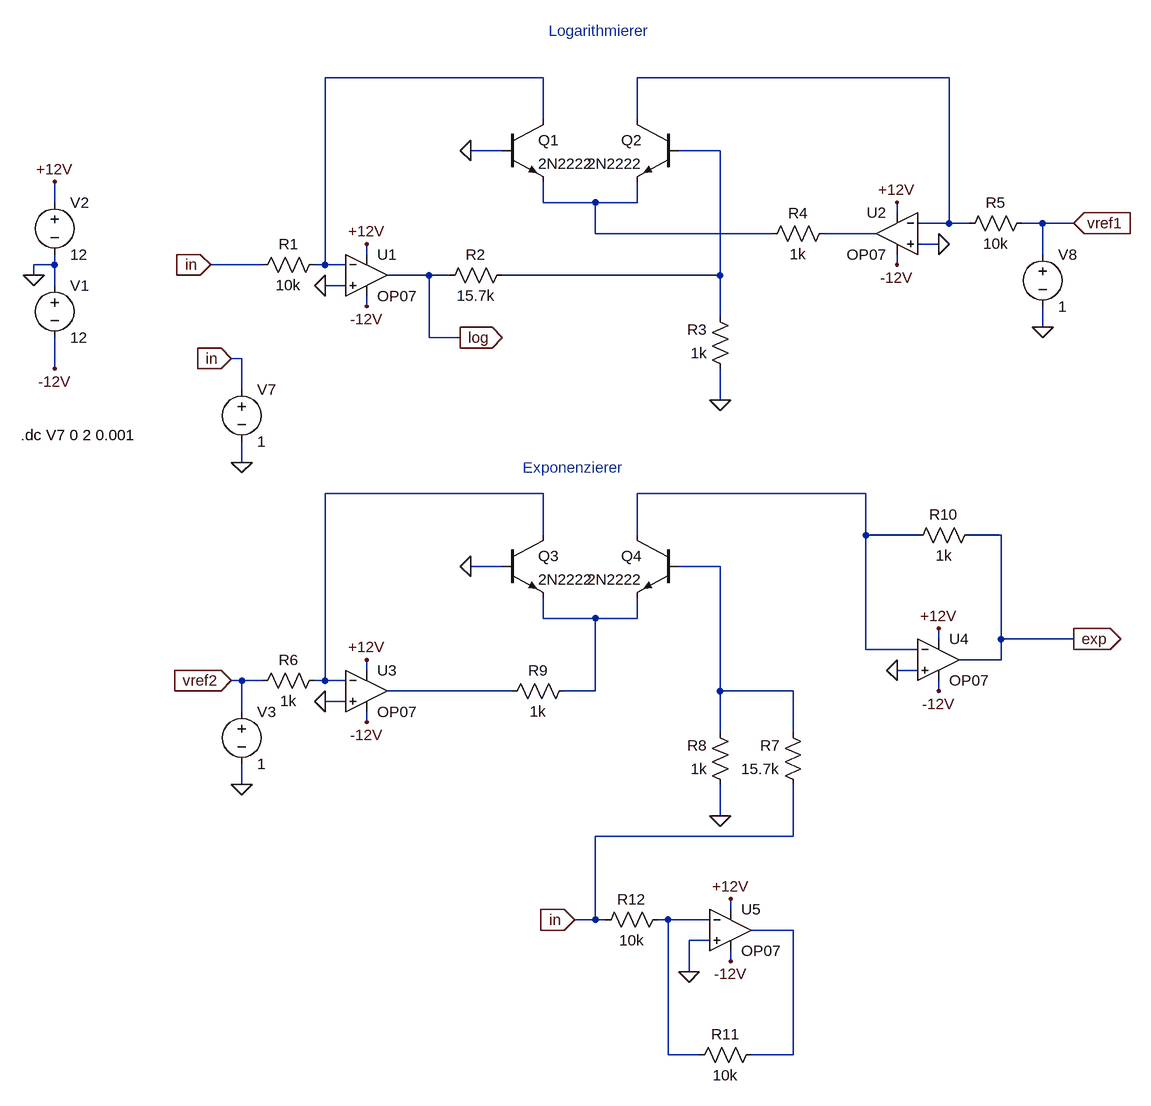
[diagram p0: schematic exponentiation.asc]
exponentiation.asc, the LTspice schematic file:
Version 4
SHEET 1 1864 1424
WIRE 608 -128 272 -128
WIRE 1232 -128 752 -128
WIRE 608 -64 608 -128
WIRE 752 -64 752 -128
WIRE 544 -16 496 -16
WIRE 880 -16 816 -16
WIRE -144 64 -144 32
WIRE 608 64 608 32
WIRE 688 64 608 64
WIRE 752 64 752 32
WIRE 752 64 688 64
WIRE 1152 80 1152 64
WIRE 1232 96 1232 -128
WIRE 1232 96 1184 96
WIRE 1264 96 1232 96
WIRE 1376 96 1344 96
WIRE 1424 96 1376 96
WIRE 688 112 688 64
WIRE 960 112 688 112
WIRE 1120 112 1040 112
WIRE 1216 128 1184 128
WIRE 336 144 336 128
WIRE 1376 144 1376 96
WIRE -144 160 -144 144
WIRE -144 160 -176 160
WIRE 176 160 96 160
WIRE 272 160 272 -128
WIRE 272 160 256 160
WIRE 304 160 272 160
WIRE 1152 160 1152 144
WIRE -176 176 -176 160
WIRE 432 176 368 176
WIRE 464 176 432 176
WIRE 880 176 880 -16
WIRE 880 176 544 176
WIRE -144 192 -144 160
WIRE 304 192 272 192
WIRE 336 224 336 208
WIRE 880 240 880 176
WIRE 1376 256 1376 224
WIRE 432 272 432 176
WIRE 480 272 432 272
WIRE 144 304 128 304
WIRE -144 320 -144 272
WIRE 144 352 144 304
WIRE 880 368 880 320
WIRE 144 464 144 432
WIRE 608 512 272 512
WIRE 1104 512 752 512
WIRE 608 576 608 512
WIRE 752 576 752 512
WIRE 1104 576 1104 512
WIRE 1184 576 1104 576
WIRE 1312 576 1264 576
WIRE 544 624 496 624
WIRE 880 624 816 624
WIRE 608 704 608 672
WIRE 688 704 608 704
WIRE 752 704 752 672
WIRE 752 704 688 704
WIRE 1216 736 1216 720
WIRE 1312 736 1312 576
WIRE 1424 736 1312 736
WIRE 1104 752 1104 576
WIRE 1184 752 1104 752
WIRE 1312 768 1312 736
WIRE 1312 768 1248 768
WIRE 336 784 336 768
WIRE 1184 784 1152 784
WIRE 144 800 128 800
WIRE 176 800 144 800
WIRE 272 800 272 512
WIRE 272 800 256 800
WIRE 304 800 272 800
WIRE 560 816 368 816
WIRE 688 816 688 704
WIRE 688 816 640 816
WIRE 880 816 880 624
WIRE 992 816 880 816
WIRE 1216 816 1216 800
WIRE 304 832 272 832
WIRE 144 848 144 800
WIRE 336 864 336 848
WIRE 880 880 880 816
WIRE 992 880 992 816
WIRE 144 960 144 928
WIRE 880 1008 880 960
WIRE 992 1040 992 960
WIRE 992 1040 688 1040
WIRE 896 1152 896 1136
WIRE 688 1168 688 1040
WIRE 688 1168 656 1168
WIRE 704 1168 688 1168
WIRE 800 1168 784 1168
WIRE 864 1168 800 1168
WIRE 992 1184 928 1184
WIRE 864 1200 832 1200
WIRE 896 1232 896 1216
WIRE 832 1248 832 1200
WIRE 800 1376 800 1168
WIRE 848 1376 800 1376
WIRE 992 1376 992 1184
WIRE 992 1376 928 1376
FLAG -144 32 +12V
FLAG -144 320 -12V
FLAG -176 176 0
FLAG 880 368 0
FLAG 496 -16 0
FLAG 1216 128 0
FLAG 272 192 0
FLAG 336 128 +12V
FLAG 336 224 -12V
FLAG 1152 64 +12V
FLAG 1152 160 -12V
FLAG 480 272 log
IOPIN 480 272 Out
FLAG 96 160 in
IOPIN 96 160 In
FLAG 1424 96 vref1
IOPIN 1424 96 In
FLAG 880 1008 0
FLAG 496 624 0
FLAG 272 832 0
FLAG 336 768 +12V
FLAG 336 864 -12V
FLAG 1216 720 +12V
FLAG 1216 816 -12V
FLAG 1424 736 exp
IOPIN 1424 736 Out
FLAG 656 1168 in
IOPIN 656 1168 In
FLAG 128 800 vref2
IOPIN 128 800 In
FLAG 1152 784 0
FLAG 144 464 0
FLAG 128 304 in
IOPIN 128 304 In
FLAG 1376 256 0
FLAG 896 1136 +12V
FLAG 896 1232 -12V
FLAG 832 1248 0
FLAG 144 960 0
SYMBOL voltage -144 176 R0
WINDOW 123 0 0 Left 0
WINDOW 39 0 0 Left 0
SYMATTR InstName V1
SYMATTR Value 12
SYMBOL voltage -144 48 R0
WINDOW 123 0 0 Left 0
WINDOW 39 0 0 Left 0
SYMATTR InstName V2
SYMATTR Value 12
SYMBOL OpAmps\\OP07 336 112 R0
SYMATTR InstName U1
SYMBOL OpAmps\\OP07 1152 48 M0
SYMATTR InstName U2
SYMBOL res 272 144 R90
WINDOW 0 0 56 VBottom 2
WINDOW 3 32 56 VTop 2
SYMATTR InstName R1
SYMATTR Value 10k
SYMBOL res 560 160 R90
WINDOW 0 0 56 VBottom 2
WINDOW 3 32 56 VTop 2
SYMATTR InstName R2
SYMATTR Value 15.7k
SYMBOL res 896 336 R180
WINDOW 0 36 76 Left 2
WINDOW 3 36 40 Left 2
SYMATTR InstName R3
SYMATTR Value 1k
SYMBOL res 944 128 R270
WINDOW 0 32 56 VTop 2
WINDOW 3 0 56 VBottom 2
SYMATTR InstName R4
SYMATTR Value 1k
SYMBOL res 1248 112 R270
WINDOW 0 32 56 VTop 2
WINDOW 3 0 56 VBottom 2
SYMATTR InstName R5
SYMATTR Value 10k
SYMBOL npn 544 -64 R0
SYMATTR InstName Q1
SYMATTR Value 2N2222
SYMBOL npn 816 -64 M0
SYMATTR InstName Q2
SYMATTR Value 2N2222
SYMBOL OpAmps\\OP07 336 752 R0
SYMATTR InstName U3
SYMBOL OpAmps\\OP07 1216 704 R0
SYMATTR InstName U4
SYMBOL res 272 784 R90
WINDOW 0 0 56 VBottom 2
WINDOW 3 32 56 VTop 2
SYMATTR InstName R6
SYMATTR Value 1k
SYMBOL res 1008 976 R180
WINDOW 0 36 76 Left 2
WINDOW 3 36 40 Left 2
SYMATTR InstName R7
SYMATTR Value 15.7k
SYMBOL res 896 976 R180
WINDOW 0 36 76 Left 2
WINDOW 3 36 40 Left 2
SYMATTR InstName R8
SYMATTR Value 1k
SYMBOL res 544 832 R270
WINDOW 0 32 56 VTop 2
WINDOW 3 0 56 VBottom 2
SYMATTR InstName R9
SYMATTR Value 1k
SYMBOL res 1168 592 R270
WINDOW 0 32 56 VTop 2
WINDOW 3 0 56 VBottom 2
SYMATTR InstName R10
SYMATTR Value 1k
SYMBOL npn 544 576 R0
SYMATTR InstName Q3
SYMATTR Value 2N2222
SYMBOL npn 816 576 M0
SYMATTR InstName Q4
SYMATTR Value 2N2222
SYMBOL voltage 144 336 R0
WINDOW 123 0 0 Left 0
WINDOW 39 0 0 Left 0
SYMATTR InstName V7
SYMATTR Value 1
SYMBOL voltage 1376 128 R0
WINDOW 123 0 0 Left 0
WINDOW 39 0 0 Left 0
SYMATTR InstName V8
SYMATTR Value 1
SYMBOL OpAmps\\OP07 896 1120 R0
SYMATTR InstName U5
SYMBOL res 944 1360 R90
WINDOW 0 0 56 VBottom 2
WINDOW 3 32 56 VTop 2
SYMATTR InstName R11
SYMATTR Value 10k
SYMBOL res 800 1152 R90
WINDOW 0 0 56 VBottom 2
WINDOW 3 32 56 VTop 2
SYMATTR InstName R12
SYMATTR Value 10k
SYMBOL voltage 144 832 R0
WINDOW 123 0 0 Left 0
WINDOW 39 0 0 Left 0
SYMATTR InstName V3
SYMATTR Value 1
TEXT -196 422 Left 2 !.dc V7 0 2 0.001
TEXT 576 472 Left 2 ;Exponenzierer
TEXT 616 -200 Left 2 ;Logarithmierer

The netlist it stands for:
* exponentiation.asc
V1 0 -12V 12
V2 +12V 0 12
XU1 0 N001 +12V -12V log LT1001  ; OP07, pins In+ In- V+ V- OUT
XU2 0 N002 +12V -12V N005 LT1001  ; OP07, pins In+ In- V+ V- OUT
R1 N001 in 10k
R2 N003 log 15.7k
R3 0 N003 1k
R4 N004 N005 1k
R5 N002 vref1 10k
Q1 N001 0 N004 0 2N2222
Q2 N002 N003 N004 0 2N2222
XU3 0 N006 +12V -12V N010 LT1001  ; OP07, pins In+ In- V+ V- OUT
XU4 0 N007 +12V -12V exp LT1001  ; OP07, pins In+ In- V+ V- OUT
R6 N006 vref2 1k
R7 in N008 15.7k
R8 0 N008 1k
R9 N010 N009 1k
R10 N007 exp 1k
Q3 N006 0 N009 0 2N2222
Q4 N007 N008 N009 0 2N2222
V7 in 0 1
V8 vref1 0 1
XU5 0 N011 +12V -12V N012 LT1001  ; OP07, pins In+ In- V+ V- OUT
R11 N012 N011 10k
R12 N011 in 10k
V3 vref2 0 1
.model NPN NPN
.model PNP PNP
.lib standard.bjt
.dc V7 0 2 0.001
* Exponenzierer
* Logarithmierer
.lib LTC.lib
.backanno
.end